# Altium schematic sheet MercurialSDR_PWR_with_dual_option.SchDoc
size A4; SheetNumber: 2; SheetTotal: 6
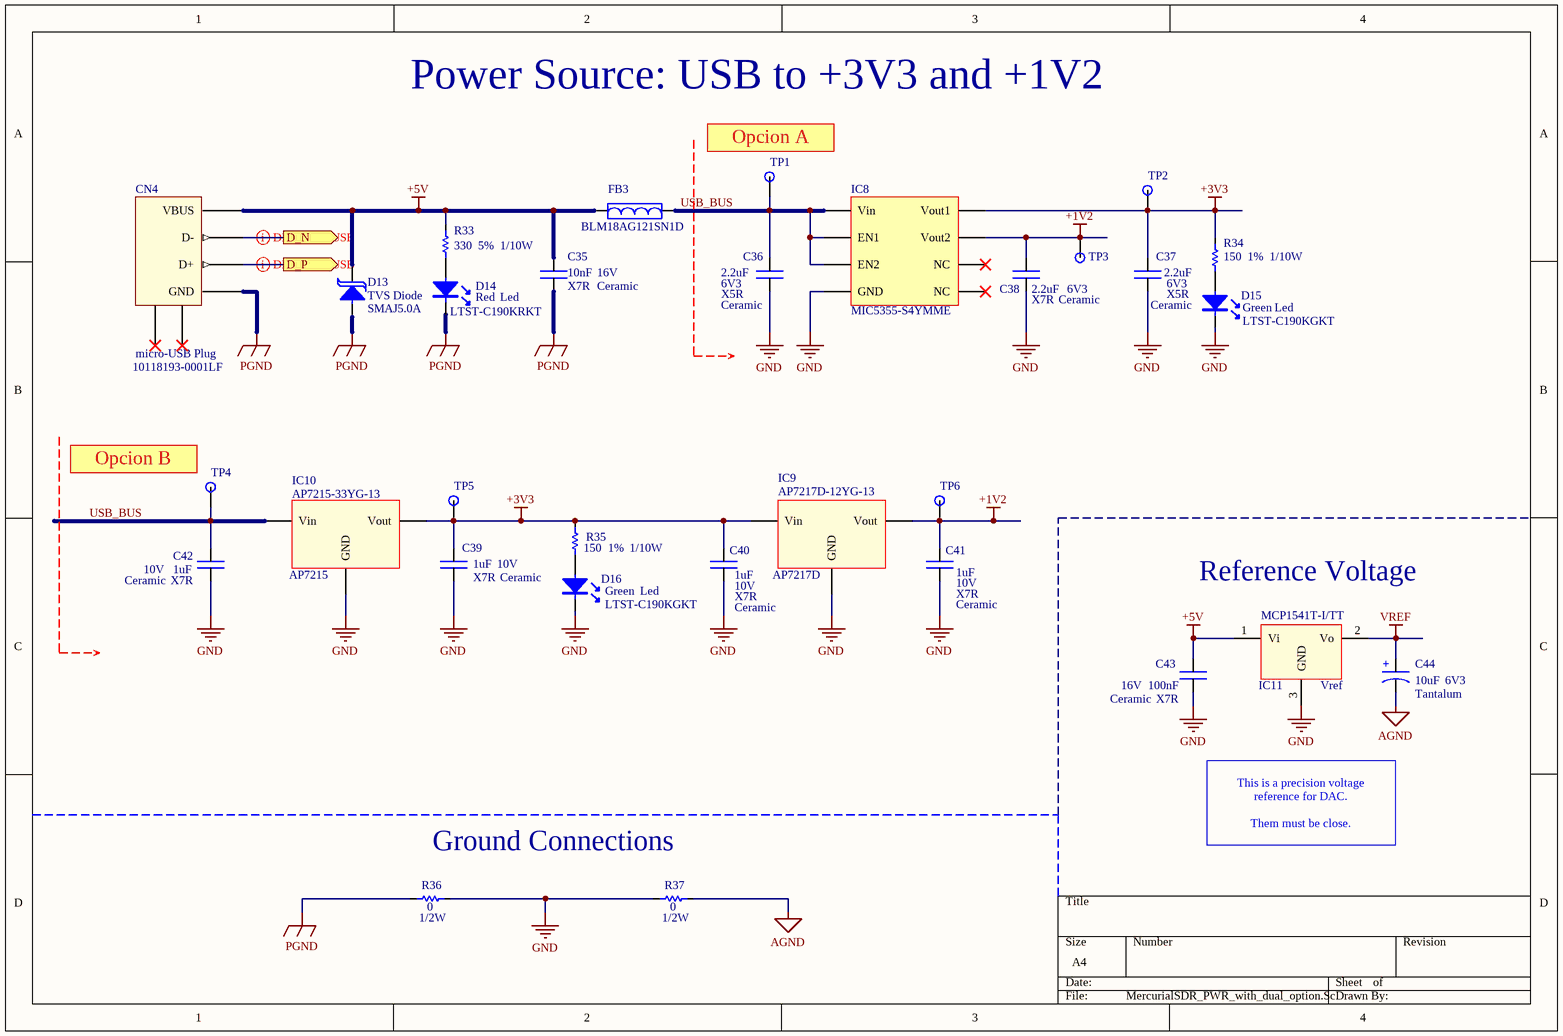
[diagram p0: MercurialSDR_PWR_with_dual_option.SchDoc]

## Parts
C35  value 10nF  Temp Coef: X7R  VR: 16V  Material: Ceramic  [CAP_0603]  (hidden comment: Capacitor)
C36  value 2.2uF  Temp Coef: X5R  VR: 6V3  Material: Ceramic  [CAP_0603]  (hidden comment: Capacitor)
C37  value 2.2uF  Temp Coef: X5R  VR: 6V3  Material: Ceramic  [CAP_0603]  (hidden comment: Capacitor)
C38  value 2.2uF  Temp Coef: X7R  VR: 6V3  Material: Ceramic  [CAP_0603]  (hidden comment: Capacitor)
C39  value 1uF  Temp Coef: X7R  VR: 10V  Material: Ceramic  [CAP_0603]  (hidden comment: Capacitor)
C40  value 1uF  Temp Coef: X7R  VR: 10V  Material: Ceramic  [CAP_0603]  (hidden comment: Capacitor)
C41  value 1uF  Temp Coef: X7R  VR: 10V  Material: Ceramic  [CAP_0603]  (hidden comment: Capacitor)
C42  value 1uF  Temp Coef: X7R  VR: 10V  Material: Ceramic  [CAP_0603]  (hidden comment: Capacitor)
C43  value 100nF  Temp Coef: X7R  VR: 16V  Material: Ceramic  [CAP_0603]  (hidden comment: Capacitor)
C44  value 10uF  VR: 6V3  Material: Tantalum  [CAP_TANT_1206]  (hidden comment: Capacitor Polarizado)
CN4  micro-USB Plug  Part Number: 10118193-0001LF  [USB_Micro]
D13  TVS Diode  Part Number: SMAJ5.0A  [DO-214AC]
D14  Led  Color: Red  Part Number: LTST-C190KRKT  [LED_0603]
D15  Led  Color: Green  Part Number: LTST-C190KGKT  [LED_0603]
D16  Led  Color: Green  Part Number: LTST-C190KGKT  [LED_0603]
FB3  Part Number: BLM18AG121SN1D  [FERRITE_BEAD_0603]  (hidden comment: Ferrite Bead)
IC8  Part Number: MIC5355-S4YMME  [MSOP-8]  (hidden comment: MIC5355)
IC9  AP7217D  Part Number: AP7217D-12YG-13  [SOT89-3L]
IC10  AP7215  Part Number: AP7215-33YG-13  [SOT89-3L]
IC11  Vref  Part Number: MCP1541T-I/TT  [SOT-23-3]
R33  value 330  Power: 1/10W  Tolerance: 5%  [RES_0603]  (hidden comment: Resistor SMD)
R34  value 150  Power: 1/10W  Tolerance: 1%  [RES_0603]  (hidden comment: Resistor SMD)
R35  value 150  Power: 1/10W  Tolerance: 1%  [RES_0603]  (hidden comment: Resistor SMD)
R36  value 0  Power: 1/2W  [0805]  (hidden comment: Resistor SMD)
R37  value 0  Power: 1/2W  [0805]  (hidden comment: Resistor SMD)
TP1  Test Point  (value not drawn)
TP2  Test Point  (value not drawn)
TP3  Test Point  (value not drawn)
TP4  Test Point  (value not drawn)
TP5  Test Point  (value not drawn)
TP6  Test Point  (value not drawn)

## Ports
D_N (out), D_P (out)

## Nets
+1V2: C38.1 C41.1 IC8.7(Vout2) IC9.3(Vout) TP3.1(TP?) TP6.1(TP?)
+3V3: C37.1 C39.1 C40.1 IC8.8(Vout1) IC9.2(Vin) IC10.3(Vout) R34.1 R35.1 TP2.1(TP?) TP5.1(TP?)
+5V: C35.1 C43.1 CN4.1(VBUS) D13.2(K) FB3.1 IC11.1(Vi) R33.1
AGND: C44.2 R37.1
GND: C36.2 C37.2 C38.2 C39.2 C40.2 C41.2 C42.2 C43.2 D15.2(K) D16.2(K) IC8.2(GND) IC9.1(GND) IC10.1(GND) IC11.3(GND) R36.1 R37.2
PGND: C35.2 CN4.4(GND) D13.1(A) D14.2(K) R36.2
VREF: C44.1 IC11.2(Vo)
D_N: CN4.2(D-) ; port D_N
D_P: CN4.3(D+) ; port D_P
USB_BUS: C36.1 C42.1 FB3.2 IC8.1(Vin) IC8.4(EN2) IC8.5(EN1) IC10.2(Vin) TP1.1(TP?) TP4.1(TP?)
NetD14_1: D14.1(A) R33.2
NetD15_1: D15.1(A) R34.2
NetD16_1: D16.1(A) R35.2

Not connected (* = marked no-connect by the designer): CN4 5(Shield)* 6(Shield)*; IC8 3(NC)* 6(NC)*

## Layout directives
differential pair: D_N, D_P

## Notes on the sheet
- Power Source: USB to +3V3 and +1V2
- (near TP1) Opcion A
- (near TP4) Opcion B
- (near IC11) Reference Voltage
- Ground Connections
- This is a precision voltage
  reference for DAC.
  Them must be close.
- (in symbol Cap Pol) +

## Library data of the parts
C35 = Cap: Capacitor no polarizado; Part Number: CC0603KRX7R7BB103
C36 C37 = Cap: Capacitor no polarizado; Part Number: CL10A225KQ8NNNC
C38 = Cap: Capacitor no polarizado; Part Number: CL10B225KQ8NFNC
C39-C42 = Cap: Capacitor no polarizado; Part Number: CL10B105KP8NNNC
C43 = Cap: Capacitor no polarizado; Part Number: CL10B104KO8NNNC
C44 = Cap Pol: Part Number: TAJA106K006RNJ; Temp Coef: *
CN4 = USB Plug
D13 = TVS_DIODE: TVS (Supresor de transitorios); Vr: 5V; Vrb: 6.4V; Vc: 9.2V
FB3 = Ferrite Bead: In: 800mA
IC8 = MIC5355: Linea Regulator Dual
IC9 = AP7217D: Linear Voltage Regulator 1V2
IC10 = AP7215: Linear Voltage Regulator 3v3
IC11 = MCP1541: Reference Voltage; Reference Voltage: 4.096V
R33 = Res: Resistor; Part Number: CR0603-JW-331ELF
R34 R35 = Res: Resistor; Part Number: ERJ-3EKF1500V
R36 R37 = Res: Resistor; Part Number: CRCW08050000Z0EAHP; Tolerance: -